# Altium project EE194_PCB.PrjPCB
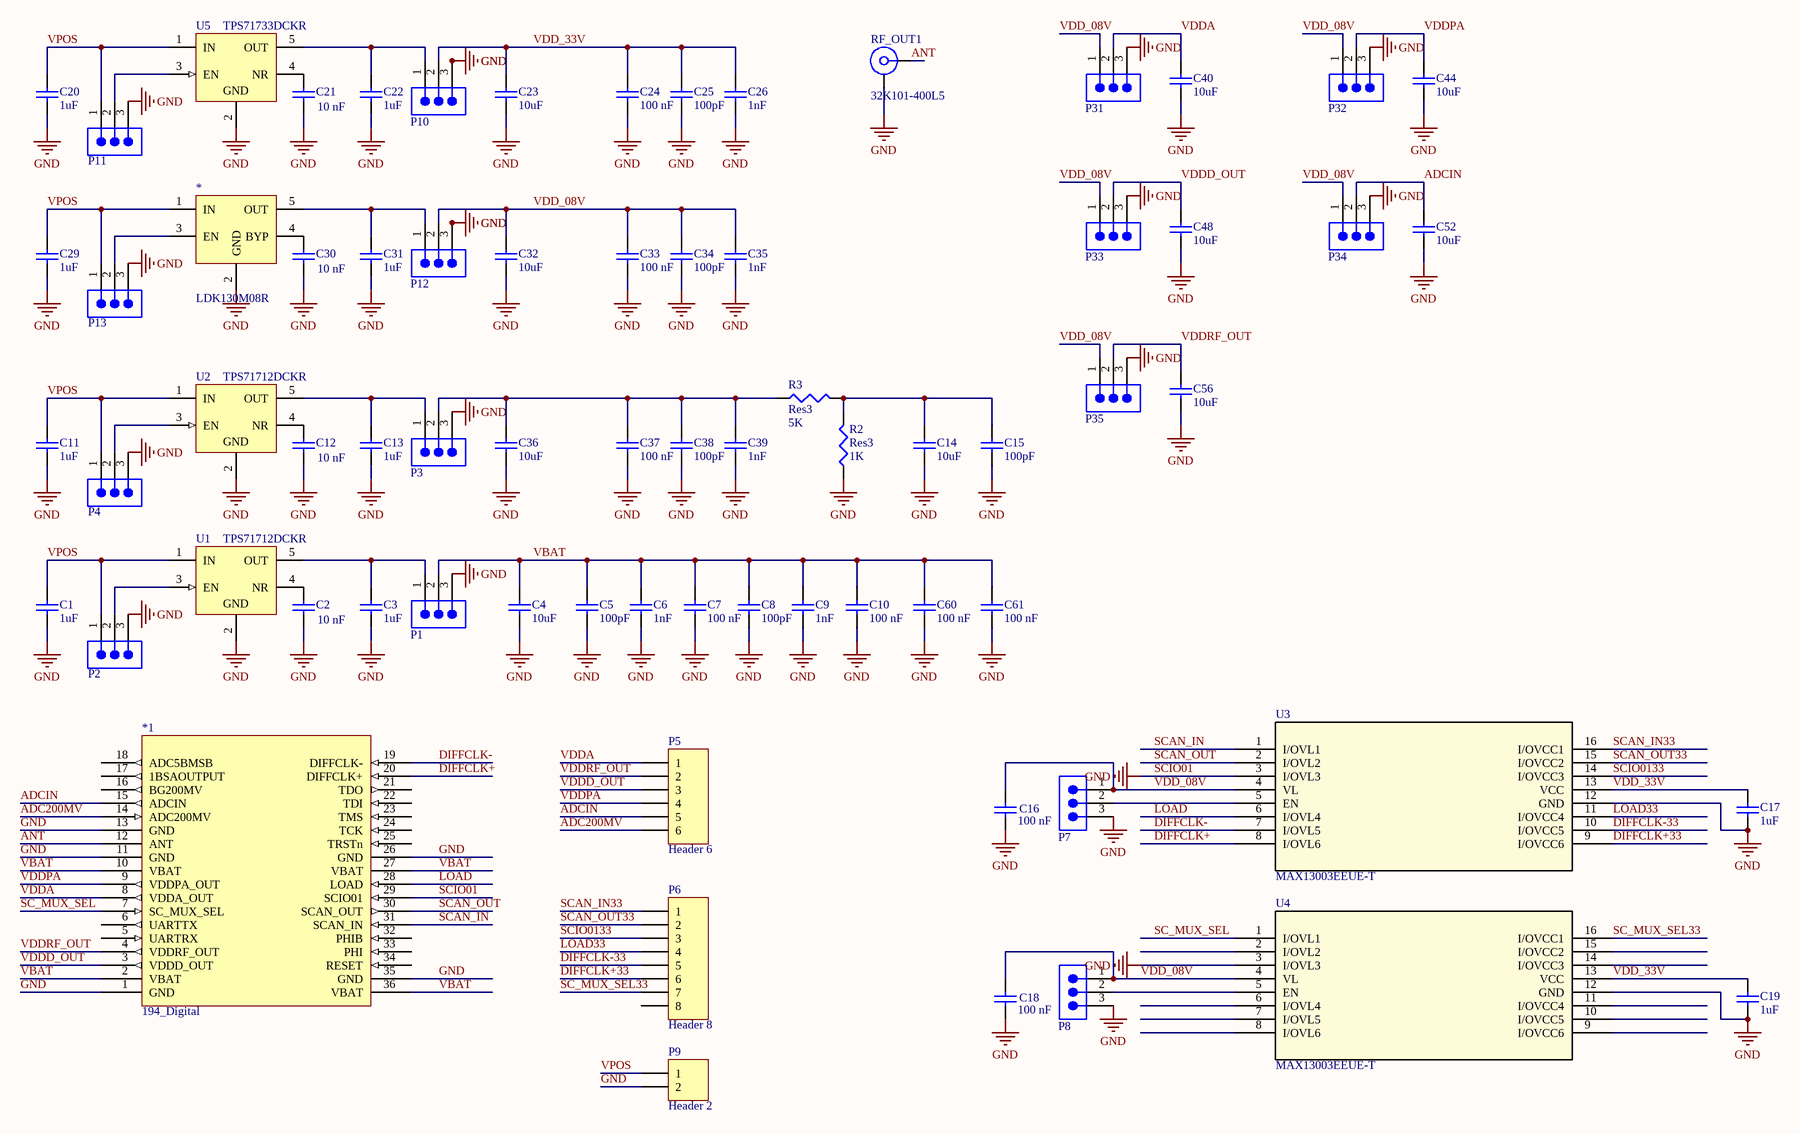
[diagram p0: EE194_PCB.SchDoc]
2 sheets, 139 parts. Net scope: global (net labels, ports and power ports of the same name join across sheets).
Board files: EE194_PCB.PcbDoc, EE194_YESDIG_PCB.PcbDoc
Sheets:
  EE194_PCB.SchDoc
  EE194_YESDIG_PCB.SchDoc

## Sheet EE194_PCB.SchDoc
size A2

### Parts
*  LDK130M08R  [SOT95P290X145-5N]
*1  194_Digital  [EE194_Analog_Chip]
C1  value 1uF  [CAPC0402(1005)60_M]  (hidden comment: CAP 1uF 16V 0402(1005))
C2  Capacitance: 10 nF  [CAPC1005X55X25LL05T10]  (hidden comment: GRM155R71H103KA88D)
C3  value 1uF  [CAPC0402(1005)60_M]  (hidden comment: CAP 1uF 16V 0402(1005))
C4  value 10uF  [CAPC0805(2012)145_N]  (hidden comment: CAP 10uF 25V 0805(2012))
C5  value 100pF  [CAPC0402(1005)60_L]  (hidden comment: CAP 100pF 16V 0402(1005))
C6  value 1nF  [CAPC0402(1005)60_L]  (hidden comment: CAP 1nF 16V 0402(1005))
C7  Capacitance: 100 nF  [CAPC1005X56X25LL10T15]  (hidden comment: 0402ZD104KAT2A)
C8  value 100pF  [CAPC0402(1005)60_L]  (hidden comment: CAP 100pF 16V 0402(1005))
C9  value 1nF  [CAPC0402(1005)60_L]  (hidden comment: CAP 1nF 16V 0402(1005))
C10  Capacitance: 100 nF  [CAPC1005X56X25LL10T15]  (hidden comment: 0402ZD104KAT2A)
C11  value 1uF  [CAPC0402(1005)60_M]  (hidden comment: CAP 1uF 16V 0402(1005))
C12  Capacitance: 10 nF  [CAPC1005X55X25LL05T10]  (hidden comment: GRM155R71H103KA88D)
C13  value 1uF  [CAPC0402(1005)60_M]  (hidden comment: CAP 1uF 16V 0402(1005))
C14  value 10uF  [CAPC0805(2012)145_N]  (hidden comment: CAP 10uF 25V 0805(2012))
C15  value 100pF  [CAPC0402(1005)60_L]  (hidden comment: CAP 100pF 16V 0402(1005))
C16  Capacitance: 100 nF  [CAPC1005X56X25LL10T15]  (hidden comment: 0402ZD104KAT2A)
C17  value 1uF  [CAPC0402(1005)60_M]  (hidden comment: CAP 1uF 16V 0402(1005))
C18  Capacitance: 100 nF  [CAPC1005X56X25LL10T15]  (hidden comment: 0402ZD104KAT2A)
C19  value 1uF  [CAPC0402(1005)60_M]  (hidden comment: CAP 1uF 16V 0402(1005))
C20  value 1uF  [CAPC0402(1005)60_M]  (hidden comment: CAP 1uF 16V 0402(1005))
C21  Capacitance: 10 nF  [CAPC1005X55X25LL05T10]  (hidden comment: GRM155R71H103KA88D)
C22  value 1uF  [CAPC0402(1005)60_M]  (hidden comment: CAP 1uF 16V 0402(1005))
C23  value 10uF  [CAPC0805(2012)145_N]  (hidden comment: CAP 10uF 25V 0805(2012))
C24  Capacitance: 100 nF  [CAPC1005X56X25LL10T15]  (hidden comment: 0402ZD104KAT2A)
C25  value 100pF  [CAPC0402(1005)60_L]  (hidden comment: CAP 100pF 16V 0402(1005))
C26  value 1nF  [CAPC0402(1005)60_L]  (hidden comment: CAP 1nF 16V 0402(1005))
C29  value 1uF  [CAPC0402(1005)60_M]  (hidden comment: CAP 1uF 16V 0402(1005))
C30  Capacitance: 10 nF  [CAPC1005X55X25LL05T10]  (hidden comment: GRM155R71H103KA88D)
C31  value 1uF  [CAPC0402(1005)60_M]  (hidden comment: CAP 1uF 16V 0402(1005))
C32  value 10uF  [CAPC0805(2012)145_N]  (hidden comment: CAP 10uF 25V 0805(2012))
C33  Capacitance: 100 nF  [CAPC1005X56X25LL10T15]  (hidden comment: 0402ZD104KAT2A)
C34  value 100pF  [CAPC0402(1005)60_L]  (hidden comment: CAP 100pF 16V 0402(1005))
C35  value 1nF  [CAPC0402(1005)60_L]  (hidden comment: CAP 1nF 16V 0402(1005))
C36  value 10uF  [CAPC0805(2012)145_N]  (hidden comment: CAP 10uF 25V 0805(2012))
C37  Capacitance: 100 nF  [CAPC1005X56X25LL10T15]  (hidden comment: 0402ZD104KAT2A)
C38  value 100pF  [CAPC0402(1005)60_L]  (hidden comment: CAP 100pF 16V 0402(1005))
C39  value 1nF  [CAPC0402(1005)60_L]  (hidden comment: CAP 1nF 16V 0402(1005))
C40  value 10uF  [CAPC0805(2012)145_N]  (hidden comment: CAP 10uF 25V 0805(2012))
C44  value 10uF  [CAPC0805(2012)145_N]  (hidden comment: CAP 10uF 25V 0805(2012))
C48  value 10uF  [CAPC0805(2012)145_N]  (hidden comment: CAP 10uF 25V 0805(2012))
C52  value 10uF  [CAPC0805(2012)145_N]  (hidden comment: CAP 10uF 25V 0805(2012))
C56  value 10uF  [CAPC0805(2012)145_N]  (hidden comment: CAP 10uF 25V 0805(2012))
C60  Capacitance: 100 nF  [CAPC1005X56X25LL10T15]  (hidden comment: 0402ZD104KAT2A)
C61  Capacitance: 100 nF  [CAPC0402(1005)60_L]  (hidden comment: 0402ZD104KAT2A)
P1  TSW-103-07-F-S  [SMTC-TSW-103-07-X-S]  (value not drawn)
P2  TSW-103-07-F-S  [SMTC-TSW-103-07-X-S]  (value not drawn)
P3  TSW-103-07-F-S  [SMTC-TSW-103-07-X-S]  (value not drawn)
P4  TSW-103-07-F-S  [SMTC-TSW-103-07-X-S]  (value not drawn)
P5  Header 6  [HDR1X6]
P6  Header 8  [HDR1X8]
P7  TSW-103-07-F-S  [SMTC-TSW-103-07-X-S]  (value not drawn)
P8  TSW-103-07-F-S  [SMTC-TSW-103-07-X-S]  (value not drawn)
P9  Header 2  [HDR1X2]
P10  TSW-103-07-F-S  [SMTC-TSW-103-07-X-S]  (value not drawn)
P11  TSW-103-07-F-S  [SMTC-TSW-103-07-X-S]  (value not drawn)
P12  TSW-103-07-F-S  [SMTC-TSW-103-07-X-S]  (value not drawn)
P13  TSW-103-07-F-S  [SMTC-TSW-103-07-X-S]  (value not drawn)
P31  TSW-103-07-F-S  [SMTC-TSW-103-07-X-S]  (value not drawn)
P32  TSW-103-07-F-S  [SMTC-TSW-103-07-X-S]  (value not drawn)
P33  TSW-103-07-F-S  [SMTC-TSW-103-07-X-S]  (value not drawn)
P34  TSW-103-07-F-S  [SMTC-TSW-103-07-X-S]  (value not drawn)
P35  TSW-103-07-F-S  [SMTC-TSW-103-07-X-S]  (value not drawn)
R2  Res3  value 1K  [J1-0603]
R3  Res3  value 5K  [J1-0603]
RF_OUT1  32K101-400L5  [ROS-32K101-400L5_V]
U1  TPS71712DCKR  [DCK0005A_L]
U2  TPS71712DCKR  [DCK0005A_L]
U3  MAX13003EEUE-T  [21-0066J_16]
U4  MAX13003EEUE-T  [21-0066J_16]
U5  TPS71733DCKR  [DCK0005A_L]

### Nets
GND: *.2(GND) *1.1(GND) *1.11(GND) *1.13(GND) *1.26(GND) *1.29(SCIO01) *1.35(GND) C1.1 C2.1 C3.1 C4.1 C5.1 C6.1 C7.1 C8.1 C9.1 C10.1 C11.1 C12.1 C13.1 C14.1 C15.1 C16.1 C17.2 C18.1 C19.2 C20.1 C21.1 C22.1 C23.1 C24.1 C25.1 C26.1 C29.1 C30.1 C31.1 C32.1 C33.1 C34.1 C35.1 C36.1 C37.1 C38.1 C39.1 C40.1 C44.1 C48.1 C52.1 C56.1 C60.1 C61.1 P1.3 P2.3 P3.3 P4.3 P7.3 P8.3 P9.2 P10.3 P11.3 P12.3 P13.3 P31.3 P32.3 P33.3 P34.3 P35.3 R2.1 RF_OUT1.MH U1.2(GND) U2.2(GND) U3.3(I/OVL3) U3.12(GND) U4.3(I/OVL3) U4.12(GND) U5.2(GND)  [also labelled SCIO01]  [project net 1BSAOUTPUT]
ADC200MV: *1.14(ADC200MV) P5.6
ADCIN: *1.15(ADCIN) C52.2 P5.5 P34.2
ANT: *1.12(ANT) RF_OUT1.1
DIFFCLK+: *1.20(DIFFCLK+) U3.8(I/OVL6)
DIFFCLK+33: P6.6 U3.9(I/OVCC6)
DIFFCLK-: *1.19(DIFFCLK-) U3.7(I/OVL5)
DIFFCLK-33: P6.5 U3.10(I/OVCC5)
LOAD: *1.28(LOAD) U3.6(I/OVL4)
LOAD33: P6.4 U3.11(I/OVCC4)
SC_MUX_SEL: *1.7(SC_MUX_SEL) U4.1(I/OVL1)
SC_MUX_SEL33: P6.7 U4.16(I/OVCC1)
SCAN_IN: *1.31(SCAN_IN) U3.1(I/OVL1)
SCAN_IN33: P6.1 U3.16(I/OVCC1)
SCAN_OUT: *1.30(SCAN_OUT) U3.2(I/OVL2)
SCAN_OUT33: P6.2 U3.15(I/OVCC2)
SCIO0133: P6.3 U3.14(I/OVCC3)
VBAT: *1.2(VBAT) *1.10(VBAT) *1.27(VBAT) *1.36(VBAT) C4.2 C5.2 C6.2 C7.2 C8.2 C9.2 C10.2 C60.2 C61.2 P1.2
VDD_08V: C16.2 C18.2 C32.2 C33.2 C34.2 C35.2 P7.1 P8.1 P12.2 P31.1 P32.1 P33.1 P34.1 P35.1 U3.4(VL) U4.4(VL)
VDD_33V: C17.1 C19.1 C23.2 C24.2 C25.2 C26.2 P10.2 U3.13(VCC) U4.13(VCC)
VDDA: *1.8(VDDA_OUT) C40.2 P5.1 P31.2
VDDD_OUT: *1.3(VDDD_OUT) C48.2 P5.3 P33.2
VDDPA: *1.9(VDDPA_OUT) C44.2 P5.4 P32.2
VDDRF_OUT: *1.4(VDDRF_OUT) C56.2 P5.2 P35.2
VPOS: *.1(IN) C1.2 C11.2 C20.2 C29.2 P2.1 P4.1 P9.1 P11.1 P13.1 U1.1(IN) U2.1(IN) U5.1(IN)
Net*_3: *.3(EN) P13.2
Net*_4: *.4(BYP) C30.2
Net*_5: *.5(OUT) C31.2 P12.1
NetC2_2: C2.2 U1.4(NR)
NetC3_2: C3.2 P1.1 U1.5(OUT)
NetC12_2: C12.2 U2.4(NR)
NetC13_2: C13.2 P3.1 U2.5(OUT)
NetC14_2: C14.2 C15.2 R2.2 R3.2
NetC21_2: C21.2 U5.4(NR)
NetC22_2: C22.2 P10.1 U5.5(OUT)
NetC36_2: C36.2 C37.2 C38.2 C39.2 P3.2 R3.1
NetP2_2: P2.2 U1.3(EN)
NetP4_2: P4.2 U2.3(EN)
NetP7_2: P7.2 U3.5(EN)
NetP8_2: P8.2 U4.5(EN)
NetP11_2: P11.2 U5.3(EN)

Not connected (* = marked no-connect by the designer): *1 5(UARTRX) 6(UARTTX) 16(BG200MV) 17(1BSAOUTPUT) 18(ADC5BMSB) 21(TDO) 22(TDI) 23(TMS) 24(TCK) 25(TRSTn) 32(PHIB) 33(PHI) 34(RESET); P6 8; U4 2(I/OVL2) 6(I/OVL4) 7(I/OVL5) 8(I/OVL6) 9(I/OVCC6) 10(I/OVCC5) 11(I/OVCC4) 14(I/OVCC3) 15(I/OVCC2)

### Library data of the parts
* = LDK130M08R: 300 mA low quiescent current very low noise LDO (800mV)
C1 C3 C11 C13 C17 C19 C20 C22 C29 C31 = CMP-1034-02119-1: CAP 1uF 16V ±10% 0402 (1005 Metric) Thickness 0.6mm SMD; Case-EIA: 0402; Tolerance: Â±10%; Case-Metric: 1005; Technology: SMT; Rated Voltage: 16 V; Max Thickness: 0.6 mm
C2 C12 C21 C30 = CMP-2008-04637-4: Chip Capacitor, 10 nF, +/- 10%, 50 V, -55 to 125 degC, 0402 (1005 Metric), RoHS, Tape and Reel; Manufacturer: Basic Passives; Case\/Package: 0402; Voltage Rating: 50 V; Type (Capacitors): X7R; DatasheetVersion: 02/2016; Mount: Surface Mount; Max Operating Temperature: 125 degC; ComponentLink1Description: Manufacturer URL; Package Quantity: 10000; Mounting Technology: Surface Mount; Radiation Hardening: No; Lead Pitch: 2mm; Length: 1 mm; Tolerance: 10%; Voltage Rating (DC): 50 V; Case Code (Metric): 1005; Packaging: Tape and Reel; Pins: 2; Width: 0.5 mm; PackageDescription: 2-Pin Surface Mount Device, Body 1 x 0.5 mm; ComponentLink1URL: http://www.murata.com/; PartNumber: GRM155R71H103KA88D; Min Operating Temperature: -55 degC; Height: 0.5 mm; RoHSCompliant: true; Case Code (Imperial): 0402; ComponentLink2URL: http://search.murata.co.jp/Ceramy/image/img/A01X/G101/ENG/GRM155R71H103KA88-01.pdf; ComponentLink2Description: Datasheet; PackageReference: 0402; REACH SVHC: No SVHC
C4 C14 C23 C32 C36 C40 C44 C48 C52 C56 = CMP-1036-04932-1: CAP 10uF 25V ±10% 0805 (2012 Metric) Thickness 1.45mm SMD; Case-EIA: 0805; Case-Metric: 2012; Tolerance: Â±10%; Technology: SMT; Rated Voltage: 25 V; Max Thickness: 1.45 mm
C5 C8 C15 C25 C34 C38 = CMP-1034-01234-1: CAP 100pF 16V ±1% 0402 (1005 Metric) Thickness 0.6mm SMD; Case-Metric: 1005; Case-EIA: 0402; Tolerance: Â±1%; Rated Voltage: 16 V; Technology: SMT; Max Thickness: 0.6 mm
C6 C9 C26 C35 C39 = CMP-1034-01615-1: CAP 1nF 16V ±1% 0402 (1005 Metric) Thickness 0.6mm SMD; Case-EIA: 0402; Case-Metric: 1005; Tolerance: Â±1%; Technology: SMT; Max Thickness: 0.6 mm; Rated Voltage: 16 V
C7 C10 C16 C18 C24 C33 C37 = CMP-2008-02878-2: Chip Capacitor, 0.1 uF, +/- 10%, 10 V, -55 to 85 degC, 0402 (1005 Metric), RoHS, Tape and Reel; Voltage Rating: 10 V; Case\Package: 0402; Type (Capacitors): X5R; Min Operating Temperature: -55 degC; Max Operating Temperature: 85 degC; ComponentLink2URL: http://datasheets.avx.com/cx5r.pdf; Packaging: Cut Tape; Tolerance: 10%; Pins: 2; Case Code (Imperial): 0402; PackageDescription: 2-Pin Surface Mount Device, Body 1 x 0.5 mm; ComponentLink1Description: Manufacturer URL; DatasheetVersion: 05/2016; Width: 0.5 mm; ComponentLink1URL: http://www.avx.com/; Length: 1 mm; Package Quantity: 1; PackageReference: 0402; Mount: Surface Mount; Radiation Hardening: No; REACH SVHC: No SVHC; Mounting Technology: Surface Mount; ComponentLink2Description: Datasheet; RoHSCompliant: true; Case Code (Metric): 1005; Height: 0.56 mm; Voltage Rating (DC): 10 V
C60 C61 = CAP-NP-2: Chip Capacitor, 0.1 uF, +/- 10%, 10 V, -55 to 85 degC, 0402 (1005 Metric), RoHS, Tape and Reel; Voltage Rating: 10 V; Case\Package: 0402; Type (Capacitors): X5R; Min Operating Temperature: -55 degC; Max Operating Temperature: 85 degC; ComponentLink2URL: http://datasheets.avx.com/cx5r.pdf; Packaging: Cut Tape; Tolerance: 10%; Pins: 2; Case Code (Imperial): 0402; PackageDescription: 2-Pin Surface Mount Device, Body 1 x 0.5 mm; ComponentLink1Description: Manufacturer URL; DatasheetVersion: 05/2016; Width: 0.5 mm; ComponentLink1URL: http://www.avx.com/; Length: 1 mm; Package Quantity: 1; PackageReference: 0402; Mount: Surface Mount; Radiation Hardening: No; REACH SVHC: No SVHC; Mounting Technology: Surface Mount; ComponentLink2Description: Datasheet; RoHSCompliant: true; Case Code (Metric): 1005; Height: 0.56 mm; Voltage Rating (DC): 10 V
P1-P4 P7 P8 P10-P13 P31-P35 = CMP-1024-00331-1: 0.025" SQ Post Header, Through-hole, Vertical, -55 to 125 degC, 2.54 mm Pitch, 3-Pin, Male, RoHS; Manufacturer: Samtec; Pitch: 2.54 mm; DatasheetVersion: F-214; ComponentLink1Description: Manufacturer URL; ComponentLink3URL: http://www.samtec.com/documents/webfiles/cpdf/TSW-XXX-XX-XXX-X-XX-XXX-MKT.pdf; Mounting Technology: Through-hole; PackageDescription: .025[0.64] SQ. Post Terminal Strip Assembly; Temperature Range: -55 to 125 degC; ComponentLink3Description: Package Specification; Orientation: Vertical; PartNumber: TSW-103-07-F-S; RoHS: True; PackageVersion: DM, 8/1988; ComponentLink2Description: Datasheet; ComponentLink1URL: http://www.samtec.com; ComponentLink2URL: http://www.samtec.com/documents/webfiles/pdf/TSW_TH.PDF; PackageReference: TSW-103-07-X-S
P5 = Header 6: Header, 6-Pin; LatestRevisionDate: 17-Jul-2002; LatestRevisionNote: Re-released for DXP Platform.; Publisher: Altium Limited
P6 = Header 8: Header, 8-Pin; LatestRevisionDate: 17-Jul-2002; LatestRevisionNote: Re-released for DXP Platform.; Publisher: Altium Limited
P9 = Header 2: Header, 2-Pin; LatestRevisionDate: 17-Jul-2002; LatestRevisionNote: Re-released for DXP Platform.; Publisher: Altium Limited
R2 R3 = Res3: Resistor; Published: 8-Jun-2000; LatestRevisionDate: 29-May-2009; LatestRevisionNote: IPC-7351 Footprint Added.; PackageReference: J1-0603; Publisher: Altium Limited; PackageDescription: Chip Resistor
RF_OUT1 = CMP-0751-00001-1: SMA Straight Jack, Up to 18 GHz, -55 to 155 degC; Manufacturer: Rosenberger; Design Note: Footprint in library is a generic example - only application specific footprint delivers High Performance; PartNumber: 32K101-400L5; PackageDescription: SMA Straight Jack, 6.35 x 6.35 x 9.5 mm; ComponentLink5URL: http://www.rosenberger.com/en/contact/sales/; DatasheetVersion: a00; ComponentLink3URL: http://rosenberger.de/ok/images/documents/db/32K101-400L5.pdf; ComponentLink4Description: Series Overview / Design Note; ComponentLink5Description: Webshop / RFQ; PackageReference: 32K101-400L5; ComponentLink2Description: Datasheet; PackageVersion: a00; ComponentLink1Description: Manufacturer URL; ComponentLink3Description: Package Specification; ComponentLink2URL: http://rosenberger.de/ok/images/documents/db/32K101-400L5.pdf; Mounting Technology: Through Hole; ComponentLink1URL: http://www.rosenberger.de; ComponentLink4URL: http://rosenberger.de/ok/images/documents/spez/32.pdf
U1 U2 = CMP-0394-00837-2: Single Output High PSRR LDO, 150 mA, Fixed 1.2 V Output, 2.5 to 6.5 V Input, 5-pin SC70 (DCK), -40 to 125 degC, Green (RoHS & no Sb/Br); Manufacturer: Texas Instruments; Accuracy(%): 3; Fixed Output Options(V): 1.2; Vin(Min)(V): 2.5; SubFamily: Single Channel LDO; Vin(Max)(V): 6.5; Iout(Max)(A): 0.15; Iq(Typ)(mA): 0.05; Vdo(Typ)(mV): 170; DatasheetVersion: SBVS068G; PackageReference: DCK0005A; PartNumber: TPS71712DCKR; ComponentLink3Description: Package Specification; Eco-Plan: Green (RoHS & no Sb/Br); ComponentLink2Description: Datasheet; PackageDescription: 5-Pin Plastic Small-Outline, Body 2 x 1.25 mm, Pitch 0.65 mm; ComponentLink1URL: http://www.ti.com/; ComponentLink1Description: Manufacturer URL; PackageVersion: 4093553-3/G; Vout Adj(Min)(V): 1.2; ComponentLink2URL: http://www.ti.com/general/docs/lit/getliterature.tsp?genericPartNumber=TPS71712&fileType=pdf; Vout Adj(Max)(V): 1.2; ComponentLink3URL: http://www.ti.com/litv/pdf/mpds025f; Mounting Technology: Surface Mount; Code_JEDEC: MO-203
U3 U4 = MAX13003EEUE-T: Imported; Vendor: Maxim; Manufacturer_Part_Number: MAX13003EEUE-T; Manufacturer_Name: Maxim; RefDes: RefDes; Type: Type; Value: Value
U5 = CMP-0394-00837-2: Single Output High PSRR LDO, 150 mA, Fixed 1.2 V Output, 2.5 to 6.5 V Input, 5-pin SC70 (DCK), -40 to 125 degC, Green (RoHS & no Sb/Br); PartNumber: TPS71712DCKR; Manufacturer: Texas Instruments; Accuracy(%): 3; Fixed Output Options(V): 1.2; Vin(Min)(V): 2.5; SubFamily: Single Channel LDO; Vin(Max)(V): 6.5; Iout(Max)(A): 0.15; Iq(Typ)(mA): 0.05; Vdo(Typ)(mV): 170; DatasheetVersion: SBVS068G; PackageReference: DCK0005A; ComponentLink3Description: Package Specification; Eco-Plan: Green (RoHS & no Sb/Br); ComponentLink2Description: Datasheet; PackageDescription: 5-Pin Plastic Small-Outline, Body 2 x 1.25 mm, Pitch 0.65 mm; ComponentLink1URL: http://www.ti.com/; ComponentLink1Description: Manufacturer URL; PackageVersion: 4093553-3/G; Vout Adj(Min)(V): 1.2; ComponentLink2URL: http://www.ti.com/general/docs/lit/getliterature.tsp?genericPartNumber=TPS71712&fileType=pdf; Vout Adj(Max)(V): 1.2; ComponentLink3URL: http://www.ti.com/litv/pdf/mpds025f; Mounting Technology: Surface Mount; Code_JEDEC: MO-203

## Sheet EE194_YESDIG_PCB.SchDoc
size A2
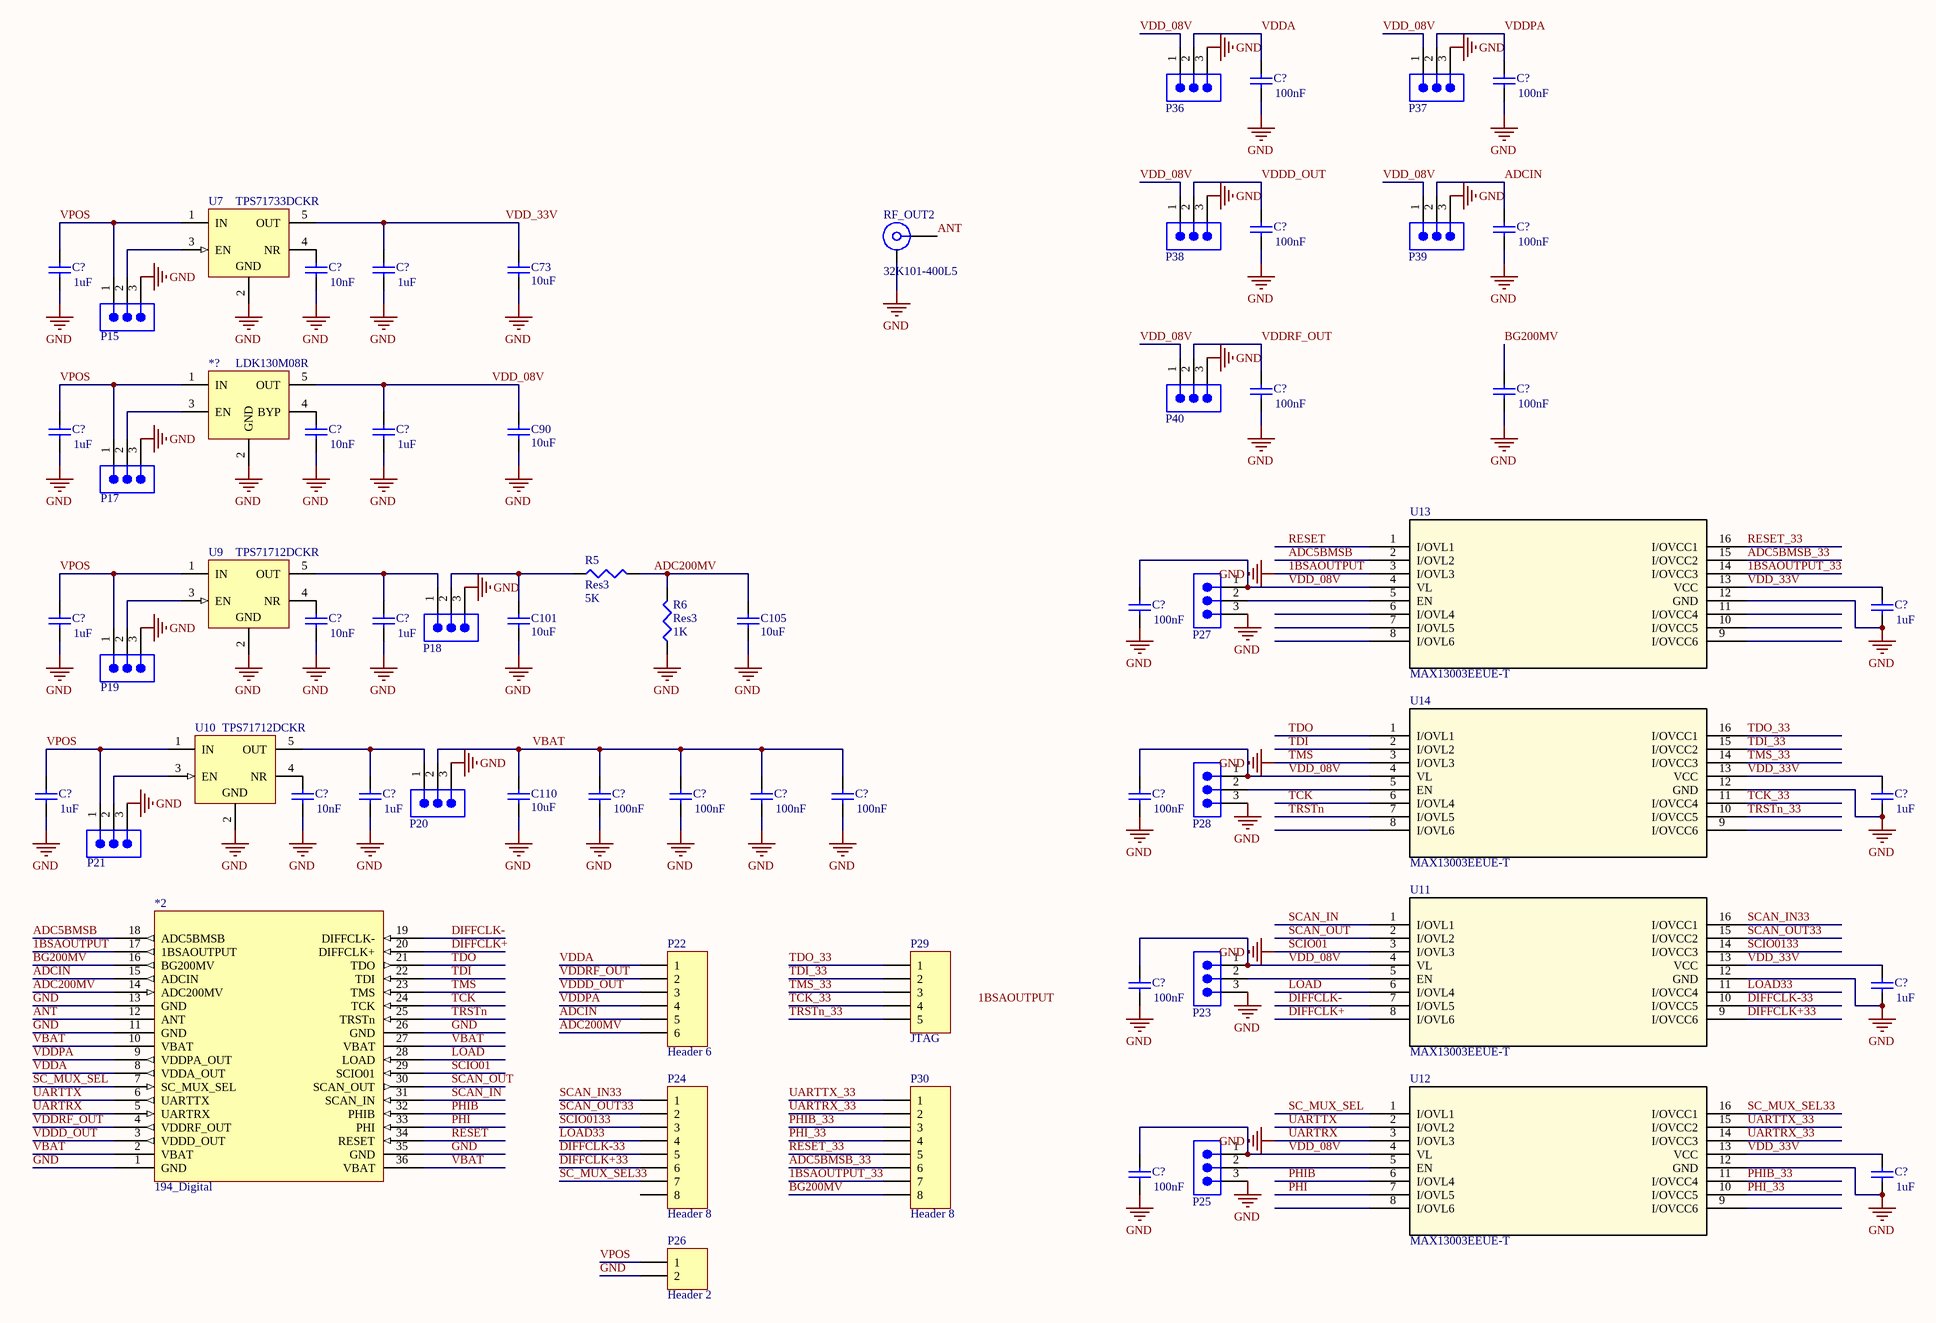
[diagram p1: EE194_YESDIG_PCB.SchDoc]

### Parts
(Parts that share a designator on the sheet are numbered #1, #2 ... from top to bottom, then left to right.)
*2  194_Digital  [EE194_Analog_Chip]
*?  LDK130M08R  [SOT95P290X145-5N]
C73  value 10uF  [CAPC0805(2012)145_N]  (hidden comment: CAP 10uF 25V 0805(2012))
C90  value 10uF  [CAPC0805(2012)145_N]  (hidden comment: CAP 10uF 25V 0805(2012))
C101  value 10uF  [CAPC0805(2012)145_N]  (hidden comment: CAP 10uF 25V 0805(2012))
C105  value 10uF  [CAPC0805(2012)145_N]  (hidden comment: CAP 10uF 25V 0805(2012))
C110  value 10uF  [CAPC0805(2012)145_N]  (hidden comment: CAP 10uF 25V 0805(2012))
C?#1  value 100nF  [0402]  (hidden comment: Cap Semi)
C?#2  value 100nF  [0402]  (hidden comment: Cap Semi)
C?#3  value 100nF  [0402]  (hidden comment: Cap Semi)
C?#4  value 100nF  [0402]  (hidden comment: Cap Semi)
C?#5  value 1uF  [6-0805_N]  (hidden comment: Cap Semi)
C?#6  value 10nF  [6-0805_N]  (hidden comment: Cap Semi)
C?#7  value 1uF  [6-0805_N]  (hidden comment: Cap Semi)
C?#8  value 100nF  [0402]  (hidden comment: Cap Semi)
C?#9  value 100nF  [0402]  (hidden comment: Cap Semi)
C?#10  value 1uF  [6-0805_N]  (hidden comment: Cap Semi)
C?#11  value 10nF  [6-0805_N]  (hidden comment: Cap Semi)
C?#12  value 1uF  [6-0805_N]  (hidden comment: Cap Semi)
C?#13  value 100nF  [0402]  (hidden comment: Cap Semi)
C?#14  value 1uF  [0402]  (hidden comment: Cap Semi)
C?#15  value 1uF  [6-0805_N]  (hidden comment: Cap Semi)
C?#16  value 10nF  [6-0805_N]  (hidden comment: Cap Semi)
C?#17  value 1uF  [6-0805_N]  (hidden comment: Cap Semi)
C?#18  value 1uF  [6-0805_N]  (hidden comment: Cap Semi)
C?#19  value 10nF  [6-0805_N]  (hidden comment: Cap Semi)
C?#20  value 1uF  [6-0805_N]  (hidden comment: Cap Semi)
C?#21  value 100nF  [0402]  (hidden comment: Cap Semi)
C?#22  value 100nF  [0402]  (hidden comment: Cap Semi)
C?#23  value 100nF  [0402]  (hidden comment: Cap Semi)
C?#24  value 100nF  [0402]  (hidden comment: Cap Semi)
C?#25  value 100nF  [0402]  (hidden comment: Cap Semi)
C?#26  value 1uF  [0402]  (hidden comment: Cap Semi)
C?#27  value 100nF  [0402]  (hidden comment: Cap Semi)
C?#28  value 1uF  [0402]  (hidden comment: Cap Semi)
C?#29  value 100nF  [0402]  (hidden comment: Cap Semi)
C?#30  value 1uF  [0402]  (hidden comment: Cap Semi)
P15  TSW-103-07-F-S  [SMTC-TSW-103-07-X-S]  (value not drawn)
P17  TSW-103-07-F-S  [SMTC-TSW-103-07-X-S]  (value not drawn)
P18  TSW-103-07-F-S  [SMTC-TSW-103-07-X-S]  (value not drawn)
P19  TSW-103-07-F-S  [SMTC-TSW-103-07-X-S]  (value not drawn)
P20  TSW-103-07-F-S  [SMTC-TSW-103-07-X-S]  (value not drawn)
P21  TSW-103-07-F-S  [SMTC-TSW-103-07-X-S]  (value not drawn)
P22  Header 6  [HDR1X6]
P23  TSW-103-07-F-S  [SMTC-TSW-103-07-X-S]  (value not drawn)
P24  Header 8  [HDR1X8]
P25  TSW-103-07-F-S  [SMTC-TSW-103-07-X-S]  (value not drawn)
P26  Header 2  [HDR1X2]
P27  TSW-103-07-F-S  [SMTC-TSW-103-07-X-S]  (value not drawn)
P28  TSW-103-07-F-S  [SMTC-TSW-103-07-X-S]  (value not drawn)
P29  JTAG  [HDR1X5]
P30  Header 8  [HDR1X8]
P36  TSW-103-07-F-S  [SMTC-TSW-103-07-X-S]  (value not drawn)
P37  TSW-103-07-F-S  [SMTC-TSW-103-07-X-S]  (value not drawn)
P38  TSW-103-07-F-S  [SMTC-TSW-103-07-X-S]  (value not drawn)
P39  TSW-103-07-F-S  [SMTC-TSW-103-07-X-S]  (value not drawn)
P40  TSW-103-07-F-S  [SMTC-TSW-103-07-X-S]  (value not drawn)
R5  Res3  value 5K  [J1-0603]
R6  Res3  value 1K  [J1-0603]
RF_OUT2  32K101-400L5  [ROS-32K101-400L5_V]
U7  TPS71733DCKR  [DCK0005A_L]
U9  TPS71712DCKR  [DCK0005A_L]
U10  TPS71712DCKR  [DCK0005A_L]
U11  MAX13003EEUE-T  [21-0066J_16]
U12  MAX13003EEUE-T  [21-0066J_16]
U13  MAX13003EEUE-T  [21-0066J_16]
U14  MAX13003EEUE-T  [21-0066J_16]

### Nets
1BSAOUTPUT: *2.1(GND) *2.5(UARTRX) *2.11(GND) *2.13(GND) *2.17(1BSAOUTPUT) *2.23(TMS) *2.26(GND) *2.29(SCIO01) *2.35(GND) *?.2(GND) C73.1 C90.1 C101.1 C105.1 C110.1 C?#1.1 C?#2.1 C?#3.1 C?#4.1 C?#5.1 C?#6.1 C?#7.1 C?#8.1 C?#9.1 C?#10.1 C?#11.1 C?#12.1 C?#13.1 C?#14.1 C?#15.1 C?#16.1 C?#17.1 C?#18.1 C?#19.1 C?#20.1 C?#21.1 C?#22.1 C?#23.1 C?#24.1 C?#25.1 C?#26.1 C?#27.1 C?#28.1 C?#29.1 C?#30.1 P15.3 P17.3 P18.3 P19.3 P20.3 P21.3 P23.3 P25.3 P26.2 P27.3 P28.3 P36.3 P37.3 P38.3 P39.3 P40.3 R6.1 RF_OUT2.MH U7.2(GND) U9.2(GND) U10.2(GND) U11.3(I/OVL3) U11.12(GND) U12.3(I/OVL3) U12.12(GND) U13.3(I/OVL3) U13.12(GND) U14.3(I/OVL3) U14.12(GND)  [also labelled GND, SCIO01, TMS, UARTRX]
1BSAOUTPUT_33: P30.7 U13.14(I/OVCC3)
ADC5BMSB: *2.18(ADC5BMSB) U13.2(I/OVL2)
ADC5BMSB_33: P30.6 U13.15(I/OVCC2)
ADC200MV: *2.14(ADC200MV) C105.2 P22.6 R5.2 R6.2
ADCIN: *2.15(ADCIN) C?#4.2 P22.5 P39.2
ANT: *2.12(ANT) RF_OUT2.1
BG200MV: *2.16(BG200MV) C?#9.2 P30.8
DIFFCLK+: *2.20(DIFFCLK+) U11.8(I/OVL6)
DIFFCLK+33: P24.6 U11.9(I/OVCC6)
DIFFCLK-: *2.19(DIFFCLK-) U11.7(I/OVL5)
DIFFCLK-33: P24.5 U11.10(I/OVCC5)
LOAD: *2.28(LOAD) U11.6(I/OVL4)
LOAD33: P24.4 U11.11(I/OVCC4)
PHI: *2.33(PHI) U12.7(I/OVL5)
PHI_33: P30.4 U12.10(I/OVCC5)
PHIB: *2.32(PHIB) U12.6(I/OVL4)
PHIB_33: P30.3 U12.11(I/OVCC4)
RESET: *2.34(RESET) U13.1(I/OVL1)
RESET_33: P30.5 U13.16(I/OVCC1)
SC_MUX_SEL: *2.7(SC_MUX_SEL) U12.1(I/OVL1)
SC_MUX_SEL33: P24.7 U12.16(I/OVCC1)
SCAN_IN: *2.31(SCAN_IN) U11.1(I/OVL1)
SCAN_IN33: P24.1 U11.16(I/OVCC1)
SCAN_OUT: *2.30(SCAN_OUT) U11.2(I/OVL2)
SCAN_OUT33: P24.2 U11.15(I/OVCC2)
SCIO0133: P24.3 U11.14(I/OVCC3)
TCK: *2.24(TCK) U14.6(I/OVL4)
TCK_33: P29.4 U14.11(I/OVCC4)
TDI: *2.22(TDI) U14.2(I/OVL2)
TDI_33: P29.2 U14.15(I/OVCC2)
TDO: *2.21(TDO) U14.1(I/OVL1)
TDO_33: P29.1 U14.16(I/OVCC1)
TMS_33: P29.3 U14.14(I/OVCC3)
TRSTn: *2.25(TRSTn) U14.7(I/OVL5)
TRSTn_33: P29.5 U14.10(I/OVCC5)
UARTRX_33: P30.2 U12.14(I/OVCC3)
UARTTX: *2.6(UARTTX) U12.2(I/OVL2)
UARTTX_33: P30.1 U12.15(I/OVCC2)
VBAT: *2.2(VBAT) *2.10(VBAT) *2.27(VBAT) *2.36(VBAT) C110.2 C?#21.2 C?#22.2 C?#23.2 C?#24.2 P20.2
VDD_08V: *?.5(OUT) C90.2 C?#12.2 C?#13.2 C?#25.2 C?#27.2 C?#29.2 P23.1 P25.1 P27.1 P28.1 P36.1 P37.1 P38.1 P39.1 P40.1 U11.4(VL) U12.4(VL) U13.4(VL) U14.4(VL)
VDD_33V: C73.2 C?#7.2 C?#14.2 C?#26.2 C?#28.2 C?#30.2 U7.5(OUT) U11.13(VCC) U12.13(VCC) U13.13(VCC) U14.13(VCC)
VDDA: *2.8(VDDA_OUT) C?#1.2 P22.1 P36.2
VDDD_OUT: *2.3(VDDD_OUT) C?#3.2 P22.3 P38.2
VDDPA: *2.9(VDDPA_OUT) C?#2.2 P22.4 P37.2
VDDRF_OUT: *2.4(VDDRF_OUT) C?#8.2 P22.2 P40.2
VPOS: *?.1(IN) C?#5.2 C?#10.2 C?#15.2 C?#18.2 P15.1 P17.1 P19.1 P21.1 P26.1 U7.1(IN) U9.1(IN) U10.1(IN)
Net*?_3: *?.3(EN) P17.2
Net*?_4: *?.4(BYP) C?#11.2
NetC101_2: C101.2 P18.2 R5.1
NetC?#6_2: C?#6.2 U7.4(NR)
NetC?#16_2: C?#16.2 U9.4(NR)
NetC?#17_2: C?#17.2 P18.1 U9.5(OUT)
NetC?#19_2: C?#19.2 U10.4(NR)
NetC?#20_2: C?#20.2 P20.1 U10.5(OUT)
NetP15_2: P15.2 U7.3(EN)
NetP19_2: P19.2 U9.3(EN)
NetP21_2: P21.2 U10.3(EN)
NetP23_2: P23.2 U11.5(EN)
NetP25_2: P25.2 U12.5(EN)
NetP27_2: P27.2 U13.5(EN)
NetP28_2: P28.2 U14.5(EN)

Not connected (* = marked no-connect by the designer): P24 8; U12 8(I/OVL6) 9(I/OVCC6); U13 6(I/OVL4) 7(I/OVL5) 8(I/OVL6) 9(I/OVCC6) 10(I/OVCC5) 11(I/OVCC4); U14 8(I/OVL6) 9(I/OVCC6)

### Notes on the sheet
- Labels drawn without touching a wire or pin: 1BSAOUTPUT

### Library data of the parts
*? = LDK130M08R: as * on sheet EE194_PCB
C73 C90 C101 C105 C110 = CMP-1036-04932-1: as C4 on sheet EE194_PCB; Technology: SMT; Rated Voltage: 25 V; Max Thickness: 1.45 mm
C?#1-C?#30 = Cap Semi: Capacitor (Semiconductor SIM Model); Published: 8-Jun-2000; LatestRevisionDate: 29-May-2009; LatestRevisionNote: IPC-7351 Footprint Added.; PackageReference: C1206; Publisher: Altium Limited; PackageDescription: Chip Capacitor
P15 P17-P21 P23 P25 P27 P28 P36-P40 = CMP-1024-00331-1: as P1 on sheet EE194_PCB; DatasheetVersion: F-214; ComponentLink1Description: Manufacturer URL; ComponentLink3URL: http://www.samtec.com/documents/webfiles/cpdf/TSW-XXX-XX-XXX-X-XX-XXX-MKT.pdf; Mounting Technology: Through-hole; PackageDescription: .025[0.64] SQ. Post Terminal Strip Assembly; Temperature Range: -55 to 125 degC; ComponentLink3Description: Package Specification; Orientation: Vertical; PartNumber: TSW-103-07-F-S; RoHS: True; PackageVersion: DM, 8/1988; ComponentLink2Description: Datasheet; ComponentLink1URL: http://www.samtec.com; ComponentLink2URL: http://www.samtec.com/documents/webfiles/pdf/TSW_TH.PDF; PackageReference: TSW-103-07-X-S
P22 = Header 6: Header, 6-Pin; LatestRevisionDate: 17-Jul-2002; LatestRevisionNote: Re-released for DXP Platform.; Publisher: Altium Limited
P24 P30 = Header 8: Header, 8-Pin; LatestRevisionDate: 17-Jul-2002; LatestRevisionNote: Re-released for DXP Platform.; Publisher: Altium Limited
P26 = Header 2: Header, 2-Pin; LatestRevisionDate: 17-Jul-2002; LatestRevisionNote: Re-released for DXP Platform.; Publisher: Altium Limited
P29 = Header 5: Header, 5-Pin; LatestRevisionDate: 17-Jul-2002; LatestRevisionNote: Re-released for DXP Platform.; Publisher: Altium Limited
R5 R6 = Res3: Resistor; Published: 8-Jun-2000; LatestRevisionDate: 29-May-2009; LatestRevisionNote: IPC-7351 Footprint Added.; PackageReference: J1-0603; Publisher: Altium Limited; PackageDescription: Chip Resistor
RF_OUT2 = CMP-0751-00001-1: as RF_OUT1 on sheet EE194_PCB; PartNumber: 32K101-400L5; PackageDescription: SMA Straight Jack, 6.35 x 6.35 x 9.5 mm; ComponentLink5URL: http://www.rosenberger.com/en/contact/sales/; DatasheetVersion: a00; ComponentLink3URL: http://rosenberger.de/ok/images/documents/db/32K101-400L5.pdf; ComponentLink4Description: Series Overview / Design Note; ComponentLink5Description: Webshop / RFQ; PackageReference: 32K101-400L5; ComponentLink2Description: Datasheet; PackageVersion: a00; ComponentLink1Description: Manufacturer URL; ComponentLink3Description: Package Specification; ComponentLink2URL: http://rosenberger.de/ok/images/documents/db/32K101-400L5.pdf; Mounting Technology: Through Hole; ComponentLink1URL: http://www.rosenberger.de; ComponentLink4URL: http://rosenberger.de/ok/images/documents/spez/32.pdf
U7 = CMP-0394-00837-2: as U5 on sheet EE194_PCB; DatasheetVersion: SBVS068G; PackageReference: DCK0005A; ComponentLink3Description: Package Specification; Eco-Plan: Green (RoHS & no Sb/Br); ComponentLink2Description: Datasheet; PackageDescription: 5-Pin Plastic Small-Outline, Body 2 x 1.25 mm, Pitch 0.65 mm; ComponentLink1URL: http://www.ti.com/; ComponentLink1Description: Manufacturer URL; PackageVersion: 4093553-3/G; Vout Adj(Min)(V): 1.2; ComponentLink2URL: http://www.ti.com/general/docs/lit/getliterature.tsp?genericPartNumber=TPS71712&fileType=pdf; Vout Adj(Max)(V): 1.2; ComponentLink3URL: http://www.ti.com/litv/pdf/mpds025f; Mounting Technology: Surface Mount; Code_JEDEC: MO-203
U9 U10 = CMP-0394-00837-2: as U1 on sheet EE194_PCB; DatasheetVersion: SBVS068G; PackageReference: DCK0005A; PartNumber: TPS71712DCKR; ComponentLink3Description: Package Specification; Eco-Plan: Green (RoHS & no Sb/Br); ComponentLink2Description: Datasheet; PackageDescription: 5-Pin Plastic Small-Outline, Body 2 x 1.25 mm, Pitch 0.65 mm; ComponentLink1URL: http://www.ti.com/; ComponentLink1Description: Manufacturer URL; PackageVersion: 4093553-3/G; Vout Adj(Min)(V): 1.2; ComponentLink2URL: http://www.ti.com/general/docs/lit/getliterature.tsp?genericPartNumber=TPS71712&fileType=pdf; Vout Adj(Max)(V): 1.2; ComponentLink3URL: http://www.ti.com/litv/pdf/mpds025f; Mounting Technology: Surface Mount; Code_JEDEC: MO-203
U11-U14 = MAX13003EEUE-T: Imported; Vendor: Maxim; Manufacturer_Part_Number: MAX13003EEUE-T; Manufacturer_Name: Maxim; RefDes: RefDes; Type: Type; Value: Value

## Nets that join several sheets
1BSAOUTPUT: EE194_PCB (76 pins), EE194_YESDIG_PCB (74 pins)
ADC200MV: EE194_PCB (*1.14 P5.6), EE194_YESDIG_PCB (5 pins)
ADCIN: EE194_PCB (*1.15 C52.2 P5.5 P34.2), EE194_YESDIG_PCB (*2.15 C?#4.2 P22.5 P39.2)
ANT: EE194_PCB (*1.12 RF_OUT1.1), EE194_YESDIG_PCB (*2.12 RF_OUT2.1)
DIFFCLK+: EE194_PCB (*1.20 U3.8), EE194_YESDIG_PCB (*2.20 U11.8)
DIFFCLK+33: EE194_PCB (P6.6 U3.9), EE194_YESDIG_PCB (P24.6 U11.9)
DIFFCLK-: EE194_PCB (*1.19 U3.7), EE194_YESDIG_PCB (*2.19 U11.7)
DIFFCLK-33: EE194_PCB (P6.5 U3.10), EE194_YESDIG_PCB (P24.5 U11.10)
LOAD: EE194_PCB (*1.28 U3.6), EE194_YESDIG_PCB (*2.28 U11.6)
LOAD33: EE194_PCB (P6.4 U3.11), EE194_YESDIG_PCB (P24.4 U11.11)
SC_MUX_SEL: EE194_PCB (*1.7 U4.1), EE194_YESDIG_PCB (*2.7 U12.1)
SC_MUX_SEL33: EE194_PCB (P6.7 U4.16), EE194_YESDIG_PCB (P24.7 U12.16)
SCAN_IN: EE194_PCB (*1.31 U3.1), EE194_YESDIG_PCB (*2.31 U11.1)
SCAN_IN33: EE194_PCB (P6.1 U3.16), EE194_YESDIG_PCB (P24.1 U11.16)
SCAN_OUT: EE194_PCB (*1.30 U3.2), EE194_YESDIG_PCB (*2.30 U11.2)
SCAN_OUT33: EE194_PCB (P6.2 U3.15), EE194_YESDIG_PCB (P24.2 U11.15)
SCIO0133: EE194_PCB (P6.3 U3.14), EE194_YESDIG_PCB (P24.3 U11.14)
VBAT: EE194_PCB (14 pins), EE194_YESDIG_PCB (10 pins)
VDD_08V: EE194_PCB (16 pins), EE194_YESDIG_PCB (20 pins)
VDD_33V: EE194_PCB (9 pins), EE194_YESDIG_PCB (11 pins)
VDDA: EE194_PCB (*1.8 C40.2 P5.1 P31.2), EE194_YESDIG_PCB (*2.8 C?#1.2 P22.1 P36.2)
VDDD_OUT: EE194_PCB (*1.3 C48.2 P5.3 P33.2), EE194_YESDIG_PCB (*2.3 C?#3.2 P22.3 P38.2)
VDDPA: EE194_PCB (*1.9 C44.2 P5.4 P32.2), EE194_YESDIG_PCB (*2.9 C?#2.2 P22.4 P37.2)
VDDRF_OUT: EE194_PCB (*1.4 C56.2 P5.2 P35.2), EE194_YESDIG_PCB (*2.4 C?#8.2 P22.2 P40.2)
VPOS: EE194_PCB (13 pins), EE194_YESDIG_PCB (13 pins)